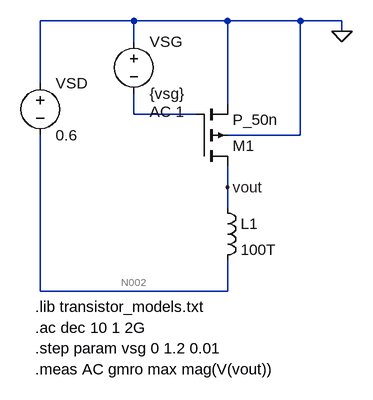
[diagram p0: schematic lab05_pmos_gmro_extract.asc]
lab05_pmos_gmro_extract.asc, the LTspice schematic file:
Version 4
SHEET 1 880 680
WIRE 144 48 0 48
WIRE 288 48 144 48
WIRE 400 48 288 48
WIRE 464 48 400 48
WIRE 464 64 464 48
WIRE 144 80 144 48
WIRE 0 144 0 48
WIRE 288 176 288 48
WIRE 144 192 144 160
WIRE 240 192 144 192
WIRE 400 224 400 48
WIRE 400 224 288 224
WIRE 288 304 288 272
WIRE 288 336 288 304
WIRE 0 464 0 224
WIRE 288 464 288 416
WIRE 288 464 0 464
FLAG 464 64 0
FLAG 288 304 vout
SYMBOL voltage 144 64 R0
WINDOW 123 24 124 Left 2
WINDOW 39 0 0 Left 0
SYMATTR Value2 AC 1
SYMATTR InstName VSG
SYMATTR Value {vsg}
SYMBOL pmos4 240 272 M180
SYMATTR InstName M1
SYMATTR Value P_50n
SYMATTR Value2 l=1u w=10u
SYMBOL voltage 0 128 R0
WINDOW 123 0 0 Left 0
WINDOW 39 0 0 Left 0
SYMATTR InstName VSD
SYMATTR Value 0.6
SYMBOL ind 272 320 R0
SYMATTR InstName L1
SYMATTR Value 100T
TEXT -8 488 Left 2 !.lib transistor_models.txt
TEXT -8 520 Left 2 !.ac dec 10 1 2G
TEXT -8 584 Left 2 !.meas AC gmro max mag(V(vout))
TEXT -8 552 Left 2 !.step param vsg 0 1.2 0.01

The netlist it stands for:
* lab05_pmos_gmro_extract.asc
VSG 0 N001 {vsg} AC 1
M1 vout N001 0 0 P_50n l=1u w=10u
VSD 0 N002 0.6
L1 vout N002 100T
.model NMOS NMOS
.model PMOS PMOS
.lib standard.mos
.lib transistor_models.txt
.ac dec 10 1 2G
.meas AC gmro max mag(V(vout))
.step param vsg 0 1.2 0.01
.backanno
.end

* Results of the author's LTspice run, read from the files saved beside the schematic
* Operating Point (first step), zero values left out:
*   V(vout) = -600 mV
*   V(n002) = -600 mV
*   Id(M1) = -30.6 nA
*   Ig(M1) = 19.04 nA
*   Is(M1) = 11.56 nA
*   I(L1) = 30.6 nA
*   I(Vsd) = -30.6 nA
*   I(Vsg) = 19.04 nA
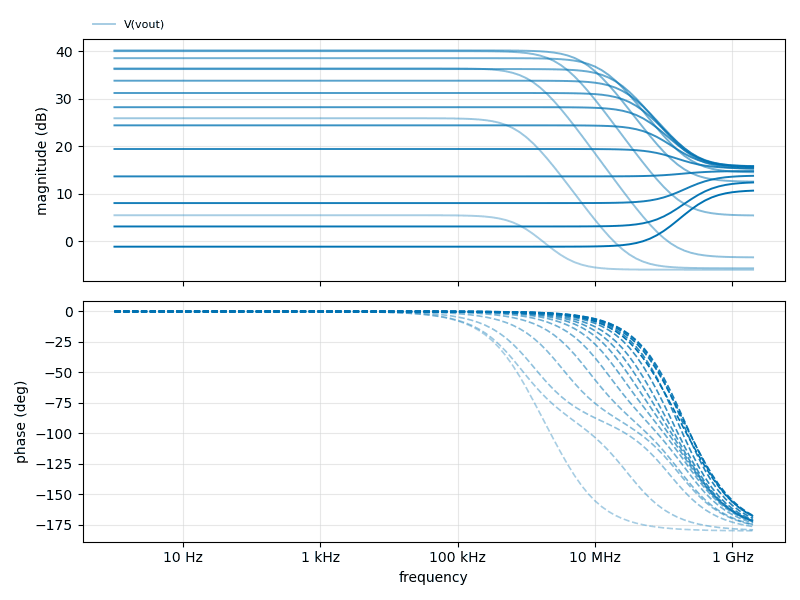
[diagram p1: AC Analysis of lab05_pmos_gmro_extract.asc, plotted from the saved traces]
* AC Analysis, 121 runs:
*   V(vout) [run 1]: 5.52 dB at 1 Hz, -5.94 dB at 2 GHz, peak 5.52 dB at 1 Hz, 3 dB below the peak at 1.01 MHz
*   V(vout) [run 2]: 25.94 dB at 1 Hz, -5.63 dB at 2 GHz, peak 25.94 dB at 1 Hz, 3 dB below the peak at 810.3 kHz
*   V(vout) [run 3]: 36.45 dB at 1 Hz, -3.33 dB at 2 GHz, peak 36.45 dB at 1 Hz, 3 dB below the peak at 1.274 MHz
*   V(vout) [run 4]: 40.06 dB at 1 Hz, 5.49 dB at 2 GHz, peak 40.06 dB at 1 Hz, 3 dB below the peak at 3.226 MHz
*   V(vout) [run 5]: 40.22 dB at 1 Hz, 12.61 dB at 2 GHz, peak 40.22 dB at 1 Hz, 3 dB below the peak at 7.521 MHz
*   V(vout) [run 6]: 38.58 dB at 1 Hz, 14.58 dB at 2 GHz, peak 38.58 dB at 1 Hz, 3 dB below the peak at 13.99 MHz
*   V(vout) [run 7]: 36.29 dB at 1 Hz, 15.28 dB at 2 GHz, peak 36.29 dB at 1 Hz, 3 dB below the peak at 21.94 MHz
*   V(vout) [run 8]: 33.85 dB at 1 Hz, 15.64 dB at 2 GHz, peak 33.85 dB at 1 Hz, 3 dB below the peak at 31.31 MHz
* From the log:
*   Measurement: gmro
*     step  MAX(mag(v(vout)))  FROM  TO
*        1  (5.52412dB,0°)  1  2e+009
*        2  (8.93177dB,0°)  1  2e+009
*        3  (11.9567dB,0°)  1  2e+009
*        4  (14.7159dB,0°)  1  2e+009
*        5  (17.2719dB,0°)  1  2e+009
*        6  (19.659dB,0°)  1  2e+009
*        7  (21.8952dB,0°)  1  2e+009
*        8  (23.9887dB,0°)  1  2e+009
*        9  (25.9417dB,0°)  1  2e+009
*       10  (27.7529dB,0°)  1  2e+009
*       11  (29.4202dB,0°)  1  2e+009
*       12  (30.9416dB,0°)  1  2e+009
*       13  (32.3172dB,0°)  1  2e+009
*       14  (33.5495dB,0°)  1  2e+009
*       15  (34.6439dB,0°)  1  2e+009
*       16  (35.6083dB,0°)  1  2e+009
*       17  (36.4526dB,0°)  1  2e+009
*       18  (37.1876dB,0°)  1  2e+009
*       19  (37.824dB,0°)  1  2e+009
*       20  (38.3721dB,0°)  1  2e+009
*       21  (38.8411dB,0°)  1  2e+009
*       22  (39.2388dB,0°)  1  2e+009
*       23  (39.5716dB,0°)  1  2e+009
*       24  (39.8449dB,0°)  1  2e+009
*       25  (40.0633dB,0°)  1  2e+009
*       26  (40.2303dB,0°)  1  2e+009
*       27  (40.3494dB,0°)  1  2e+009
*       28  (40.4235dB,0°)  1  2e+009
*       29  (40.4556dB,0°)  1  2e+009
*       30  (40.4485dB,0°)  1  2e+009
*       31  (40.405dB,0°)  1  2e+009
*       32  (40.328dB,0°)  1  2e+009
*       33  (40.2205dB,0°)  1  2e+009
*       34  (40.0852dB,0°)  1  2e+009
*       35  (39.925dB,0°)  1  2e+009
*       36  (39.7427dB,0°)  1  2e+009
*       37  (39.5407dB,0°)  1  2e+009
*       38  (39.3216dB,0°)  1  2e+009
*       39  (39.0876dB,0°)  1  2e+009
*       40  (38.8408dB,0°)  1  2e+009
*     ...